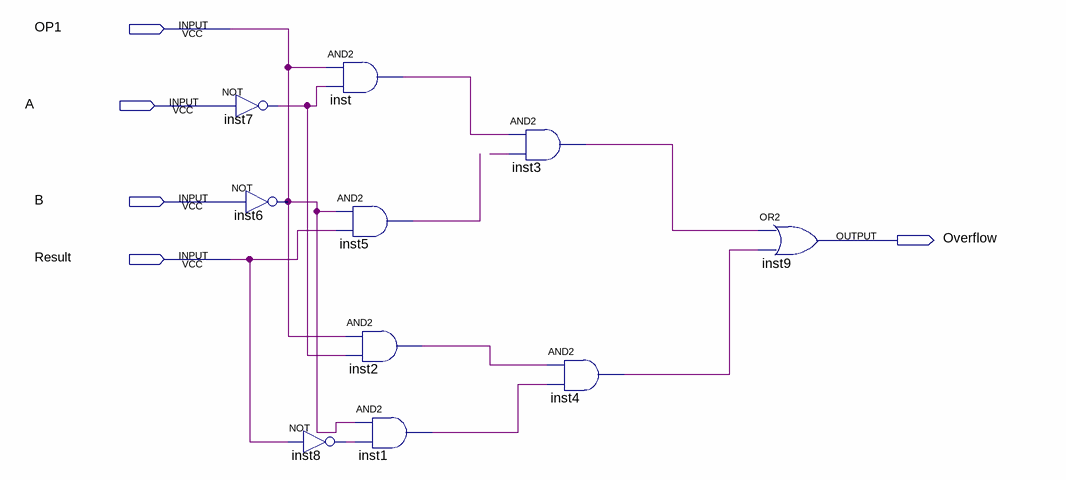
[diagram p0: schematic sheet]
// Quartus schematic BasicLogicCalculator.bdf as structural Verilog: 10 symbols, 5 pins
module BasicLogicCalculator (
  input  OP1,
  input  A,
  input  B,
  input  Result,
  output Overflow
);

  wire inst1_out, inst2_out, inst3_out, inst4_out, inst5_out, inst7_out, inst8_out, inst_out, undriven;

  not inst7 (inst7_out, A);
  not inst6 (OP1, B);
  not inst8 (inst8_out, Result);
  and inst (inst_out, OP1, inst7_out);
  and inst5 (inst5_out, OP1, Result);
  and inst2 (inst2_out, OP1, inst7_out);
  and inst1 (inst1_out, OP1, inst8_out);
  and inst3 (inst3_out, inst_out, undriven);
  and inst4 (inst4_out, inst2_out, inst1_out);
  or inst9 (Overflow, inst3_out, inst4_out);
endmodule
